# Altium schematic sheet RT_SUPER_HOST_A.SchDoc
size D; Organization: Altium Limited; Address1: 3 Minna Close; Address2: Belrose; Address3: NSW 2085; Address4: Australia; DocumentNumber: 1; SheetNumber: 1; SheetTotal: 1; PAGE_TITLE: TOP LEVEL
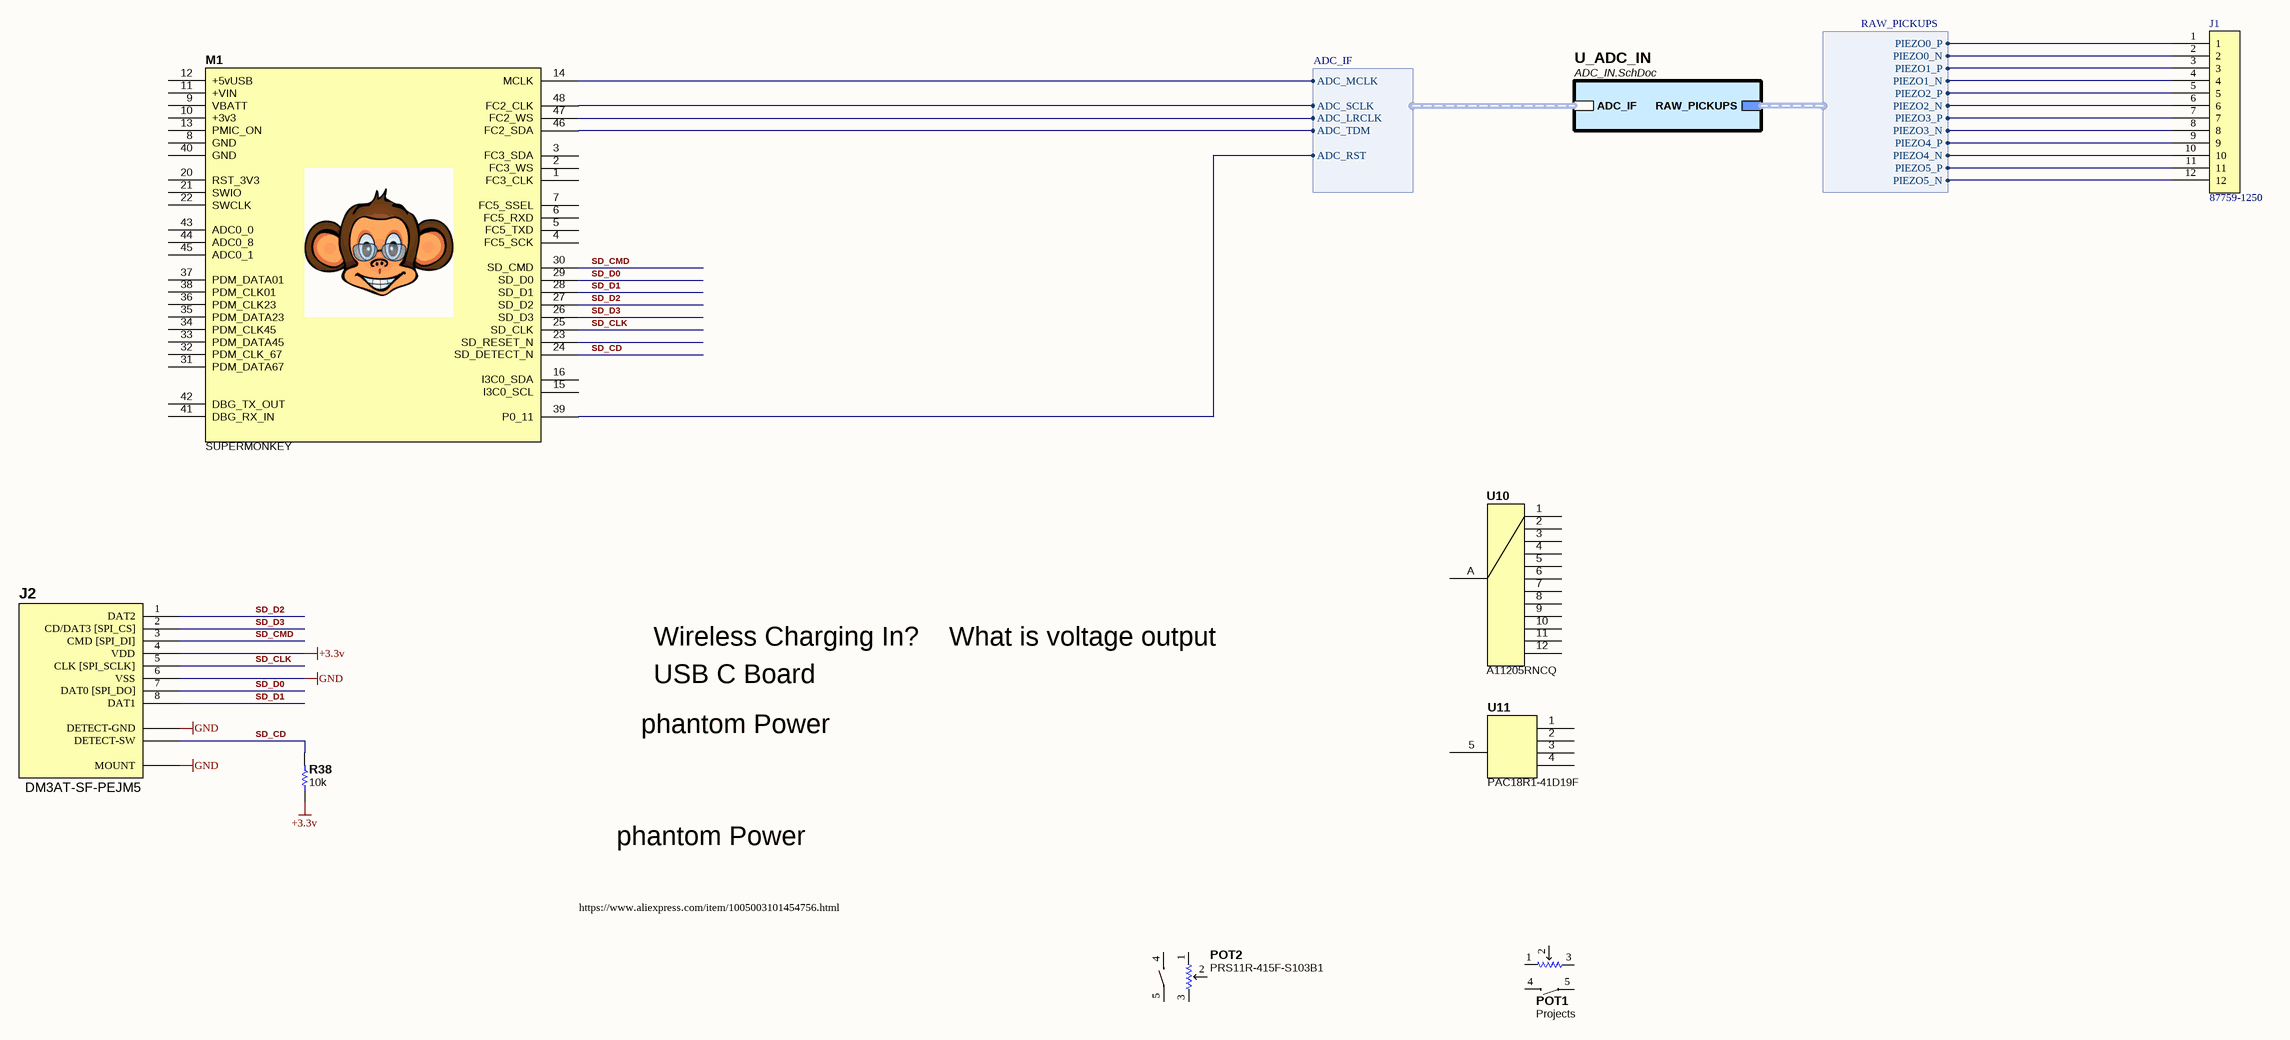
[diagram p0: RT_SUPER_HOST_A.SchDoc]

## Parts
J1  87759-1250  [87759-1250]
J2  DM3AT-SF-PEJM5  [DM3AT-SF-PEJM5]
M1  SUPERMONKEY  [SUPERMONKEY]
POT1  Projects  [PRS11R420FS103B1]
POT2  PRS11R-415F-S103B1  [PRS11R415FS103B1]
R38  10k  [R0402_0.40MM_MD]
U10  A11205RNCQ  [A11205RNCQ]
U11  PAC18R1-41D19F  [PAC18R1]

## Sub-sheets
U_ADC_IN = ADC_IN.SchDoc: RAW_PICKUPS (harness RAW_PICKUPS), ADC_IF (harness ADC_IF)

## Harnesses
ADC_IF: ADC_MCLK, ADC_LRCLK, ADC_SCLK, ADC_TDM, ADC_RST
RAW_PICKUPS: PIEZO0_N, PIEZO0_P, PIEZO1_P, PIEZO1_N, PIEZO2_P, PIEZO2_N, PIEZO3_P, PIEZO3_N, PIEZO4_P, PIEZO4_N, PIEZO5_P, PIEZO5_N

## Nets
+3.3v: J2.4(VDD) R38.1
GND: J2.6(VSS) J2.CDA(DETECT-GND) J2.M(MOUNT)
SD_CD: J2.CDB(DETECT-SW) M1.24(SD_DETECT_N) R38.2
SD_CLK: J2.5(CLK_[SPI_SCLK]) M1.25(SD_CLK)
SD_CMD: J2.3(CMD_[SPI_DI]) M1.30(SD_CMD)
SD_D0: J2.7(DAT0_[SPI_DO]) M1.29(SD_D0)
SD_D1: J2.8(DAT1) M1.28(SD_D1)
SD_D2: J2.1(DAT2) M1.27(SD_D2)
SD_D3: J2.2(CD/DAT3_[SPI_CS]) M1.26(SD_D3)
NetJ1_1: J1.1 ; sheet U_ADC_IN/RAW_PICKUPS.PIEZO0_P
NetJ1_2: J1.2 ; sheet U_ADC_IN/RAW_PICKUPS.PIEZO0_N
NetJ1_3: J1.3 ; sheet U_ADC_IN/RAW_PICKUPS.PIEZO1_P
NetJ1_4: J1.4 ; sheet U_ADC_IN/RAW_PICKUPS.PIEZO1_N
NetJ1_5: J1.5 ; sheet U_ADC_IN/RAW_PICKUPS.PIEZO2_P
NetJ1_6: J1.6 ; sheet U_ADC_IN/RAW_PICKUPS.PIEZO2_N
NetJ1_7: J1.7 ; sheet U_ADC_IN/RAW_PICKUPS.PIEZO3_P
NetJ1_8: J1.8 ; sheet U_ADC_IN/RAW_PICKUPS.PIEZO3_N
NetJ1_9: J1.9 ; sheet U_ADC_IN/RAW_PICKUPS.PIEZO4_P
NetJ1_10: J1.10 ; sheet U_ADC_IN/RAW_PICKUPS.PIEZO4_N
NetJ1_11: J1.11 ; sheet U_ADC_IN/RAW_PICKUPS.PIEZO5_P
NetJ1_12: J1.12 ; sheet U_ADC_IN/RAW_PICKUPS.PIEZO5_N
NetM1_14: M1.14(MCLK) ; sheet U_ADC_IN/ADC_IF.ADC_MCLK
NetM1_39: M1.39(P0_11) ; sheet U_ADC_IN/ADC_IF.ADC_RST
NetM1_46: M1.46(FC2_SDA) ; sheet U_ADC_IN/ADC_IF.ADC_TDM
NetM1_47: M1.47(FC2_WS) ; sheet U_ADC_IN/ADC_IF.ADC_LRCLK
NetM1_48: M1.48(FC2_CLK) ; sheet U_ADC_IN/ADC_IF.ADC_SCLK

Not connected (* = marked no-connect by the designer): M1 1(FC3_CLK) 2(FC3_WS) 3(FC3_SDA) 4(FC5_SCK) 5(FC5_TXD) 6(FC5_RXD) 7(FC5_SSEL) 8(GND) 9(VBATT) 10(+3v3) 11(+VIN) 12(+5vUSB) 13(PMIC_ON) 15(I3C0_SCL) 16(I3C0_SDA) 20(RST_3V3) 21(SWIO) 22(SWCLK) 23(SD_RESET_N) 31(PDM_DATA67) 32(PDM_CLK_67) 33(PDM_DATA45) 34(PDM_CLK45) 35(PDM_DATA23) 36(PDM_CLK23) 37(PDM_DATA01) 38(PDM_CLK01) 40(GND) 41(DBG_RX_IN) 42(DBG_TX_OUT) 43(ADC0_0) 44(ADC0_8) 45(ADC0_1); POT1 1 2 3 4 5; POT2 1 2 3 4 5; U10 1 2 3 4 5 6 7 8 9 10 11 12 A; U11 1 2 3 4 5

## Notes on the sheet
- Wireless Charging In?    What is voltage output
- USB C Board
- phantom Power
- https://www.aliexpress.com/item/1005003101454756.html
- PCB REV
- CCA REV
- Sheet
- of

## Library data of the parts
J1 = 87759-1250: CONN HEADER 12POS 2MM VERT SMD; Manufacturer: Molex Connector Corporation; Connector Type: Header, Unshrouded; Number of Positions: 12; Number of Positions Loaded: All; Pitch: 0.079" (2.00mm); Value: 87759-1250; Supplier 1: Digi-Key; Supplier Part Number 1: WM18653-ND; Manufacturer Part Number: 87759-1250; RoHS: RoHS Compliant; Category: Connectors, Interconnects; Stock 1: 1595; Pricing 1: 1=2.07, 10=1.823, 100=1.2155, 500=0.9724, 1000=0.80709 (USD); Contact Type: Male Pin; Number of Rows: 2; Row Spacing: 0.079" (2.00mm); Contact Mating Length: 0.150" (3.81mm); Mounting Type: Surface Mount; Termination: Solder; Fastening Type: -; Features: Board Guide; Contact Finish: Gold; Contact Finish Thickness: 15µin (0.38µm); Color: Black; Packaging: Tube; ComponentLink1URL: http://www.molex.com/pdm_docs/sd/877591250_sd.pdf; ComponentLink1Description: http://www.molex.com/pdm_docs/sd/877591250_sd.pdf
J2 = DM3AT-SF-PEJM5: CONN MICRO SD R/A PUSH-PUSH SMD; Manufacturer: Hirose Electric Co Ltd; Card Type: Secure Digital - microSD™; Number of Positions: 10 (8 + 2); Connector Type: Connector and Ejector; Insertion, Removal Method: Push In, Push Out; Supplier 1: Digi-Key; Supplier Part Number 1: HR1964CT-ND; Manufacturer Part Number: DM3AT-SF-PEJM5; RoHS: RoHS Compliant; Category: Connectors, Interconnects; Stock: 28699; Pricing: 1=2.83, 10=2.72, 25=2.4932, 50=2.3798, 100=2.2664, 250=1.98312, 500=1.92648 (USD); Packaging: Cut Tape (CT); Ejector Side: -; Mounting Type: Surface Mount, Right Angle; Features: Switch; Height Above Board: 0.066" (1.68mm); Mounting Feature: Normal, Standard - Top; Contact Finish: Gold; Contact Finish Thickness: -; ComponentLink1URL: http://www.hirose.co.jp/cataloge_hp/e60900232.pdf; ComponentLink1Description: http://www.hirose.co.jp/cataloge_hp/e60900232.pdf; Value: DM3AT-SF-PEJM5
POT1 = PRS11R-420F-S103B1: Manufacturer: Bourns; Manufacturer Part Number: PRS11R-415F-S103B1; Supplier 1: Mouser; Supplier Part Number 1: 652-PRS11R415FS103B1; RoHS: No; Stock 1: 729; Pricing: 1=3.76000, 10=3.30000, 50=3.30000, 100=2.70000, 1000=1.82000, 10000=1.70000 (USD); Value: Projects
POT2 = PRS11R-415F-S103B1: Manufacturer: Bourns; Supplier 1: Mouser; Supplier Part Number 1: 652-PRS11R415FS103B1; Manufacturer Part Number: PRS11R-415F-S103B1; RoHS: No; Stock 1: 729; Pricing: 1=3.76000, 10=3.30000, 50=3.30000, 100=2.70000, 1000=1.82000, 10000=1.70000 (USD); Value: PRS11R-415F-S103B1
R38 = ERJ-2RKF1002X: RES 10K OHM 1/10W 1% 0402 SMD; Manufacturer: Panasonic Electronic Components; Package Power: 0402  (0.1W); Power (Watts): 0.1W- 1/10W; Temperature Coefficient: ±100ppm/°C; Limiting Element Voltage: 50; Maximum Overload Voltage: 100; Maximum Working Voltage: 31.6V; Substitution Notes: 10k , ±1% , 0402 , AEC-Q200; Value: 10k; Manufacturer Part Number: ERJ-2RKF1002X; ComponentLink1Description: Internal Datasheet; ComponentLink1URL: datasheets\Panasonic Electronic Components\AOA0000CE2.pdf; ComponentLink2Description: External Datasheet; ComponentLink2URL: http://industrial.panasonic.com/www-data/pdf/AOA0000/AOA0000CE2.pdf; Supplier 1: Digi-Key; Supplier Part Number 1: P10.0KLCT-ND; Category: Resistors; Resistance (Ohms): 10k; Composition: Thick Film; Features: -; Tolerance: ±1%; Package: 0402 (1005 Metric); Supplier Package: 0402; Size / Dimension: 0.039" L x 0.020" W (1.00mm x 0.50mm); Height: 0.40MM; Number of Terminations: 2; Packaging: Cut Tape (CT); Sort Value: 10000; Sort Value Package: 402_10000; Ratings: AEC-Q200
U10 = A11205RNCQ: Switch Rotary N.O./N.C. SP12T 12 Flatted Shaft PC Pins 2.5A 125VAC 125VDC Automotive; Manufacturer: ITT C&K; Actuator Material: Nylon,Glass; Throw Configuration: SP,SP12T; Number of Positions: 12; Contact Style: Non-Shorting; Voltage Rating (AC): 125V; Number of Decks: 1; Index Angle: 30°; Electrical Life: 300000Cycles; Index Stops: Fixed; Actuator Length: 12.7mm; Supplier 1: Digi-Key; Supplier Part Number 1: CKN6042-ND; Manufacturer Part Number: A11205RNCQ; RoHS: Yes; Category: Rotary Switches; Stock 1: 2149; Pricing: 1=10.02000, 5=8.59800, 10=8.05100, 36=7.38194, 72=6.89514, 108=6.48963, 252=5.94202, 468=5.57701, 972=5.27280 (USD); Mount: Through Hole,Panel; Contact Material: Silver; Contact Plating: Silver; Housing Material: Nylon; Min Operating Temperature: -30°C; Max Operating Temperature: 85°C; Termination: PC Pin; Package Quantity: 1; Max Current Rating: 2.5A; Max Voltage Rating (AC): 125V; Voltage Rating (DC): 125V; Max Voltage Rating (DC): 125V; Current Rating: 2.5A; Number of Poles per Deck: 1; Orientation: Straight; Series: A; Packaging: Bulk; Voltage Rating: 125V; Length: 26.19mm; Depth: 26.19mm; Radiation Hardening: No; Lead Free: Lead Free; RoHS Compliant: Yes; ComponentLink1URL: https://datasheet.ciiva.com/2887/a-rotary-30juyl14-2887303.pdf?src-supplier=Digi-Key; ComponentLink1Description: https://datasheet.ciiva.com/2887/a-rotary-30juyl14-2887303.pdf?src-supplier=Digi-Key; Value: A11205RNCQ
U11 = PAC18R1-41D19F: Manufacturer: Bourns; Supplier 1: Mouser; Supplier Part Number 1: 652-PAC18R1-41D19F; Manufacturer Part Number: PAC18R1-41D19F; RoHS: No; Stock 1: 1877; Pricing: 1=3.26000, 10=3.04000, 50=2.60000, 100=2.45000, 1000=2.00000, 10000=1.91000 (USD); Value: PAC18R1-41D19F